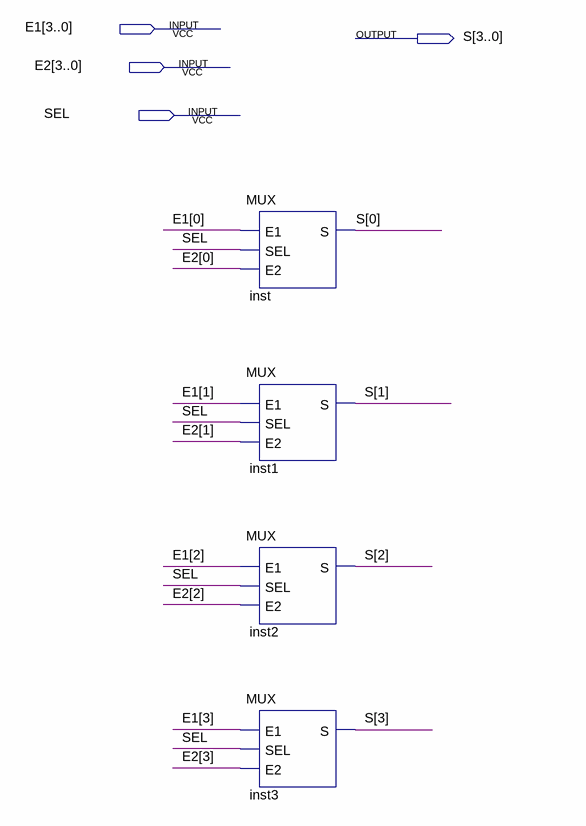
[diagram p0: schematic sheet]
// Quartus schematic MUX_4.bdf as structural Verilog: 4 symbols, 4 pins
module MUX_4 (
  input  [3:0] E1,
  input  [3:0] E2,
  input  SEL,
  output [3:0] S
);

  MUX inst (.E1(E1[0]), .SEL(SEL), .E2(E2[0]), .S(S[0]));
  MUX inst1 (.E1(E1[1]), .SEL(SEL), .E2(E2[1]), .S(S[1]));
  MUX inst2 (.E1(E1[2]), .SEL(SEL), .E2(E2[2]), .S(S[2]));
  MUX inst3 (.E1(E1[3]), .SEL(SEL), .E2(E2[3]), .S(S[3]));
endmodule
